# EAGLE design 180dof-micro (EAGLE 5.04)
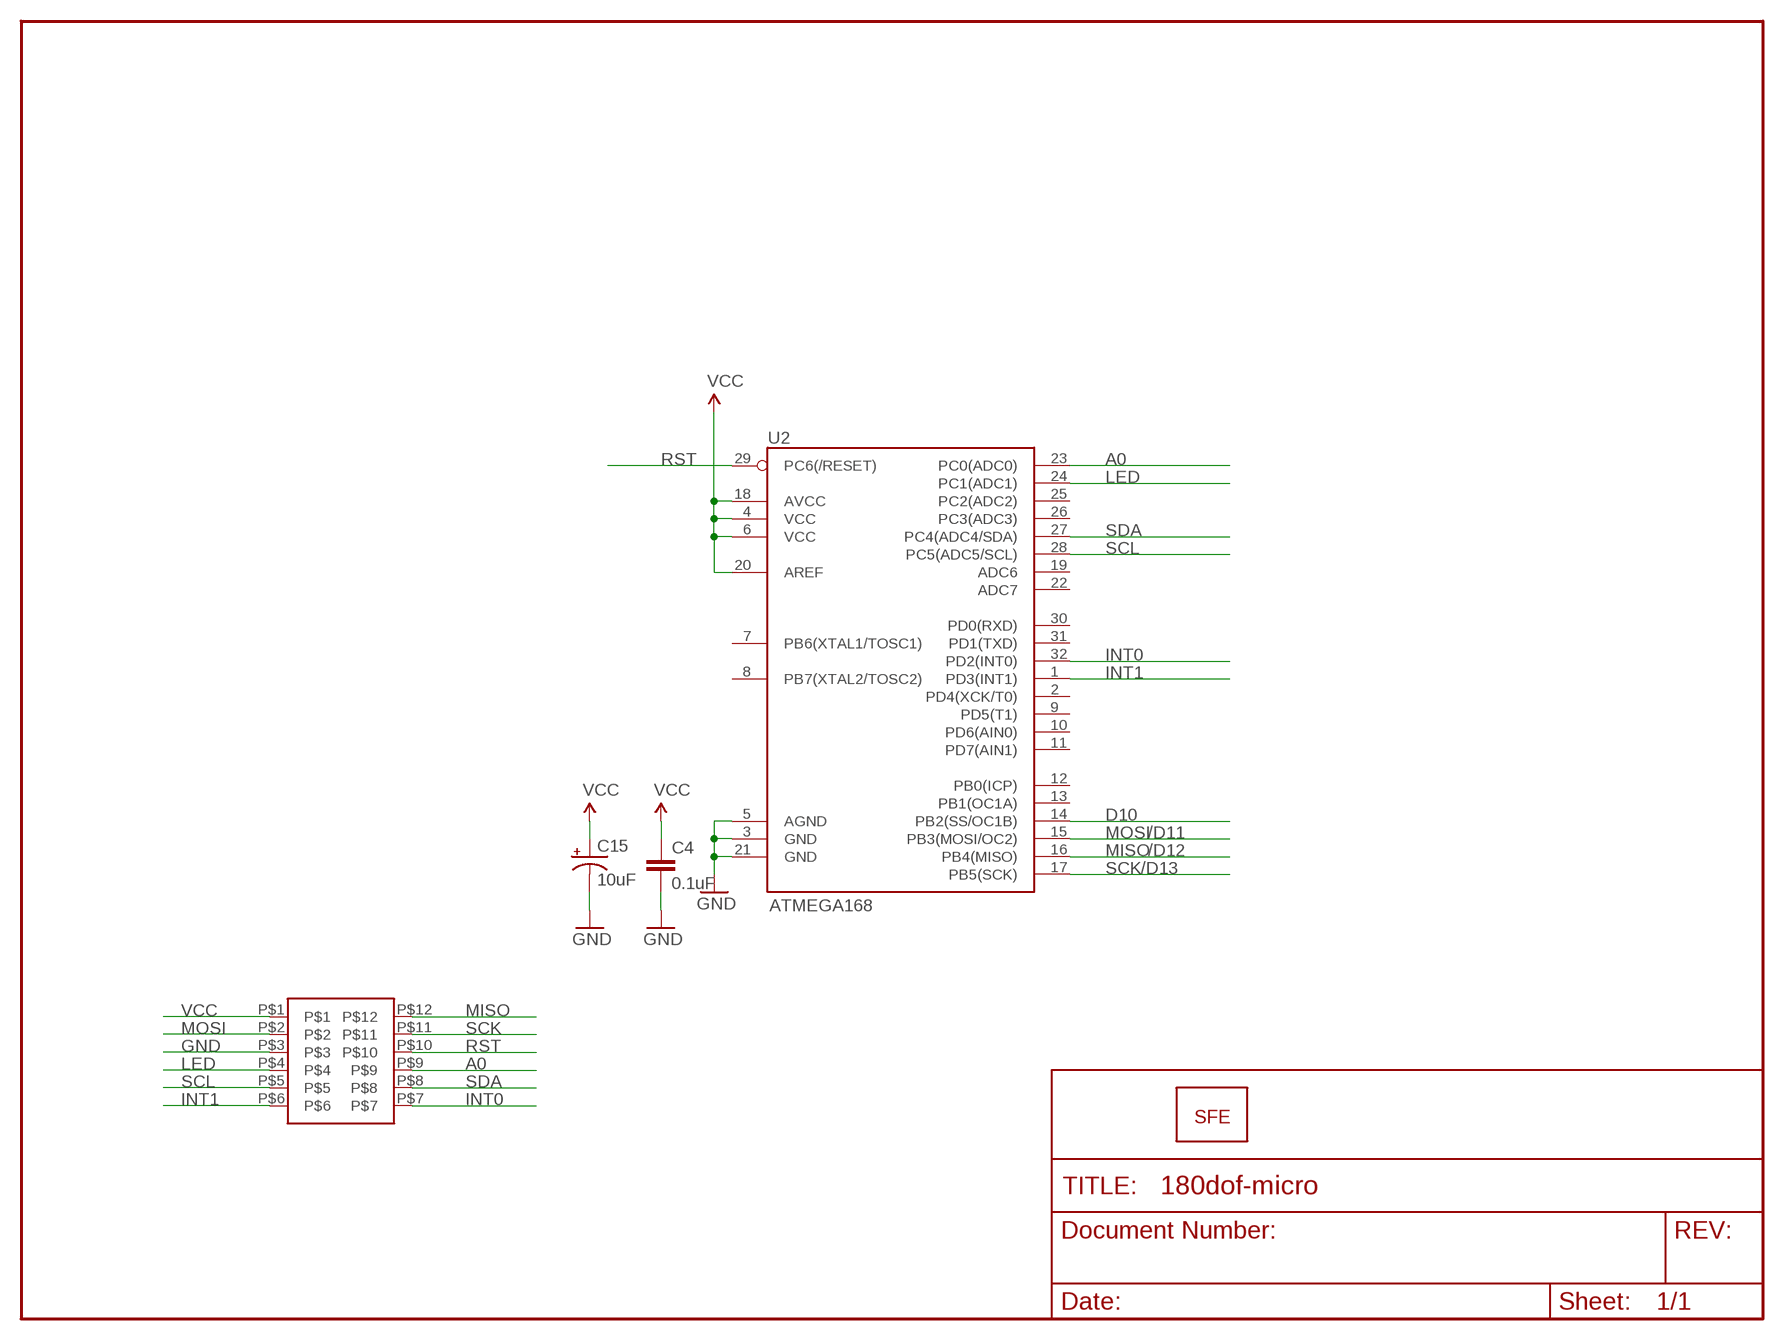
[diagram p0: schematic, sheet 1]

## Parts
C4  0.1uF  CAP0603-CAP  [0603-CAP]
C15  10uF  CAP_POL1206  [EIA3216]
JP1  LOGO-SFESK  [SFE-LOGO-FLAME]
U2  ATMEGA168  [TQFP32-08]
U$1  6DOF-DIGITAL-TESTER-2X6PORT  [6DOF-DIGITAL-TESTER-2X6PORT]

## Nets
A0: U2.23(PC0(ADC0)) U$1.P$9
D10: U2.14(PB2(SS/OC1B))
GND: C4.2 C15.C(-) U2.3(GND) U2.5(AGND) U2.21(GND) U$1.P$3
INT0: U2.32(PD2(INT0)) U$1.P$7
INT1: U2.1(PD3(INT1)) U$1.P$6
LED: U2.24(PC1(ADC1)) U$1.P$4
MISO: U2.16(PB4(MISO)) U$1.P$12
MOSI: U2.15(PB3(MOSI/OC2)) U$1.P$2
RST: U2.29(PC6(/RESET)) U$1.P$10
SCK: U2.17(PB5(SCK)) U$1.P$11
SCL: U2.28(PC5(ADC5/SCL)) U$1.P$5
SDA: U2.27(PC4(ADC4/SDA)) U$1.P$8
VCC: C4.1 C15.A(+) U2.4(VCC) U2.6(VCC) U2.18(AVCC) U2.20(AREF) U$1.P$1
Unconnected: U2.2(PD4(XCK/T0)) U2.7(PB6(XTAL1/TOSC1)) U2.8(PB7(XTAL2/TOSC2)) U2.9(PD5(T1)) U2.10(PD6(AIN0)) U2.11(PD7(AIN1)) U2.12(PB0(ICP)) U2.13(PB1(OC1A)) U2.19(ADC6) U2.22(ADC7) U2.25(PC2(ADC2)) U2.26(PC3(ADC3)) U2.30(PD0(RXD)) U2.31(PD1(TXD))

## Notes on the sheet
- /D11
- /D12
- /D13

## Library data of the parts
C4 = SparkFun:CAP: Capacitor Standard 0603 ceramic capacitor, and 0.1" leaded capacitor.
C15 = SparkFun:CAP_POL: Capacitor Polarized These are standard SMD and PTH capacitors. Normally 10uF, 47uF, and 100uF in electrolytic and tantalum varieties. Always verify the external diameter of the through hole cap, it varies with capacity, voltage, and manufacturer. The EIA devices should be standard.
JP1 = SparkFun:LOGO-SFE: Spark Fun Electronics PCB Logo This is the standard Spark Fun Electronics PCB logo.
U2 = SparkFun:ATMEGA168
U$1 = unclepetes:6DOF-DIGITAL-TESTER-2X6PORT

## Net classes
0 Default: width 0.203 mm
1 vcc: width 0.254 mm

## Board
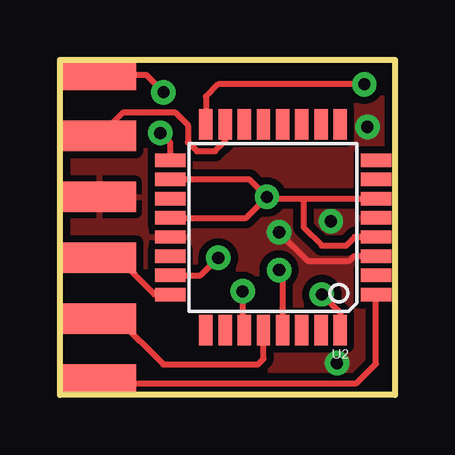
[diagram p1: board, top side]
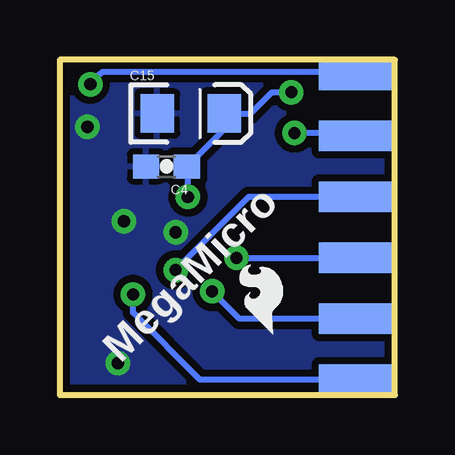
[diagram p2: board, bottom side, seen from below]

Size 13.97 x 13.97 mm. Coordinates in mm from the lower left corner, seen from the top.
Outline: 0,0 0,13.97 13.97,13.97 13.97,0 0,0
Copper layers (1*16): Top 0.035mm / dielectric 1.5mm / Bottom 0.035mm
Design rules "SparkFun *": minimum track width 8mil, minimum drill 20mil, track to track 8mil, track to pad 8mil, pad to pad 8mil, via to via 8mil, smd to smd 8mil, copper to edge 8mil, drill to drill 8mil, minimum pad ring 12mil, minimum via ring 10mil, stop-mask expansion 4mil, vias tented up to drill 20mil, thermal gap 10mil

### Footprints (pad centres in the part's own frame; a part is rotated, then mirrored left to right if it is on the bottom)
0603-CAP = smd 1.1 x 1: 1 -0.85,0; 2 0.85,0
EIA3216 = smd 1.4 x 1.6: A 1.4,0; C -1.4,0
TQFP32-08 = smd 1.27 x 0.559: 1 -4.293,2.8; 2 -4.293,2; 3 -4.293,1.2; 4 -4.293,0.4; 5 -4.293,-0.4; 6 -4.293,-1.2; 7 -4.293,-2; 8 -4.293,-2.8; 17 4.293,-2.8; 18 4.293,-2; 19 4.293,-1.2; 20 4.293,-0.4; 21 4.293,0.4; 22 4.293,1.2; 23 4.293,2; 24 4.293,2.8 | smd 0.559 x 1.27: 9 -2.8,-4.293; 10 -2,-4.293; 11 -1.2,-4.293; 12 -0.4,-4.293; 13 0.4,-4.293; 14 1.2,-4.293; 15 2,-4.293; 16 2.8,-4.293; 25 2.8,4.293; 26 2,4.293; 27 1.2,4.293; 28 0.4,4.293; 29 -0.4,4.293; 30 -1.2,4.293; 31 -2,4.293; 32 -2.8,4.293
6DOF-DIGITAL-TESTER-2X6PORT = smd 3.048 x 1.27: P$1 0,12.7; P$2 0,10.16; P$3 0,7.62; P$4 0,5.08; P$5 0,2.54; P$6 0,0 | smd 3.048 x 1.27 bottom: P$7 0,0; P$8 0,2.54; P$9 0,5.08; P$10 0,7.62; P$11 0,10.16; P$12 0,12.7

### Placement (x,y rotation side)
C4  9.53,9.53 180 bottom
C15  8.51,11.73 0 bottom
JP1  5.08,2.54 45 bottom
U2  8.89,6.99 180 top
U$1  1.65,0.64 0 top

### Tracks (layer width: path | path; a pad name or v marks a point on that pad's centre or on a via)
A0  (via drill 0.51)
  Top 0.254: U2.23 5.87,4.99 v6.6,5.71
  Bottom 0.254: 1.14,5.21 U$1.P$9 v6.6,5.71
GND  (via drill 0.51)
  Top 0.254: U2.3 12.26,5.79 12.06,5.59 10.34,5.59 v9.14,6.78
  other vias: 11.3,7.24 11.56,1.32 12.83,11.18
  pour Top (isolate 0.305): 0,0 13.97,0 13.97,13.97 0,13.97
  pour Bottom (isolate 0.305): 0,0 13.97,0 13.97,13.97 0,13.97
INT0  (via drill 0.51)
  Top 0.254: U2.32 11.69,3.42 v10.92,4.19
  Bottom 0.254: v10.92,4.19 10.92,3.43 8.13,0.64 U$1.P$7
INT1
  Top 0.254: U2.1 13.18,1.29 12.37,0.48 2.18,0.48 2.03,0.64 U$1.P$6
LED
  Top 0.254: U2.24 3.94,4.18 2.67,5.46 1.91,5.46 U$1.P$4
MISO  (via drill 0.51)
  Top 0.254: U2.16 6.09,12.44 6.6,12.95 v12.7,12.95
  Bottom 0.254: v12.7,12.95 12.7,13.08 12.19,13.46 0.89,13.46 U$1.P$12
MOSI
  Top 0.254: U2.15 6.89,10.57 6.48,10.16 5.71,10.16 5.33,10.54 5.33,11.25 4.8,11.79 2.64,11.79 U$1.P$2
RST  (via drill 0.51)
  Top 0.254: U2.29 9.29,5.06 v9.14,5.21
  Bottom 0.254: U$1.P$10 6.1,8.26 v9.14,5.21
SCK  (via drill 0.51)
  Top 0.254: U2.17 4.6,10.52 v4.19,10.92
  Bottom 0.254: v4.19,10.92 0.76,10.92 U$1.P$11
SCL
  Top 0.254: U2.28 8.49,1.5 8.26,1.27 4.32,1.27 2.41,3.17 U$1.P$5
SDA  (via drill 0.51)
  Top 0.254: v7.62,4.32 7.62,2.76 U2.27
  Bottom 0.254: U$1.P$8 6.48,3.17 v7.62,4.32
VCC  (via drill 0.51)
  Top 0.254: 10.16,8.19 U2.6 | 12.46,6.58 U2.4 12.3,6.58 11.94,6.22 10.92,6.22 10.16,6.99 10.16,8.19 | U2.20 7.77,7.38 v8.64,8.26 | U2.18 7.91,8.98 v8.64,8.26 | 10.16,8.19 8.71,8.19 v8.64,8.26 | U$1.P$1 3.61,13.34 v4.32,12.62
  Bottom 0.254: v8.64,8.26 8.64,9.49 C4.1 7.11,11.09 C15.A 6.02,11.73 5.13,12.62 v4.32,12.62

### Text on the board
bPlace: MegaMicro
Reference: 0.75 inch total space between PB and PM